# Altium project ISPR_DEOP.PrjPcb
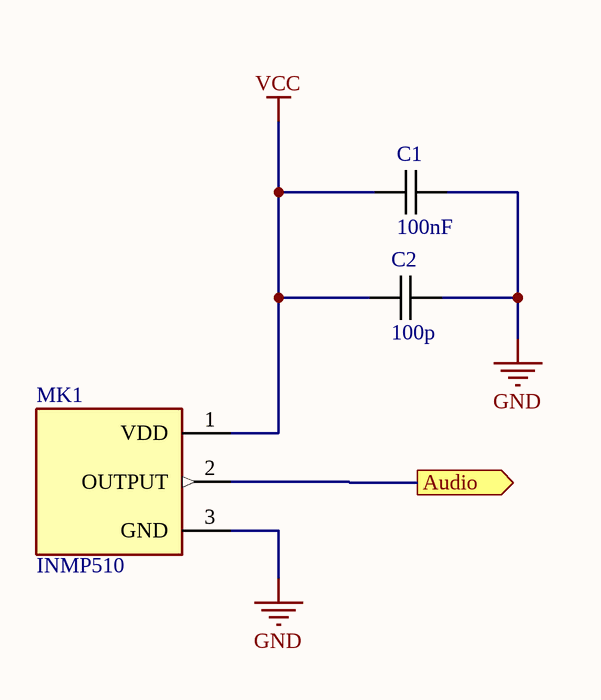
[diagram p0: Microfono.SchDoc]
3 sheets, 36 parts. Net scope: flat (ports and power ports of the same name join across sheets).
Board file: PCB_Microfonos.PcbDoc
Sheets:
  Microfono.SchDoc
  Filter.SchDoc
  Connector.SchDoc

## Sheet Microfono.SchDoc: Microfono
size A4; Author: Jose Luis Llorente Gonzalez; CompanyName: ETSIT; Organization: UPM; Revision: V1.0

### Parts
C1  100nF  [0805C-TBD]
C2  100p  [0805C-GENERIC]
MK1  INMP510  [XDCR_INMP510]

### Ports
Audio (out)

### Nets
GND: C1.2 C2.2 MK1.3(GND)
VCC: C1.1 C2.1 MK1.1(VDD)
NetC5_1: MK1.2(OUTPUT) ; port Audio

### Notes on the sheet
- Title
- Size:
- Date:
- A4
- Number:
- Time:
- Revision:
- Sheet
- of
- File:

### Library data of the parts
C1 = 0805C-100nF-25V-X7R-MUR: CAPACITOR 0805 CERAMIC; Supplier 1: Digi-Key; Supplier Part Number 1: 490-1673-1-ND
C2 = C0805-GENERIC: GENERIC CAPACITOR NON POLARISED0603
MK1 = INMP510: 60Hz ~ 20kHz Analog Microphone MEMS _Silicon_ 1.5V ~ 3.63V Omnidirectional _-38dB Â±2dB @ 94dB SPL_ Solder Pads; MF: TDK InvenSense; Value: *; MP: INMP510; SnapEDA_Link: https://www.snapeda.com/parts/INMP510/TDK%20InvenSense/view-part/2757133/?ref=snap; Package: LGA-3 TDK-InvenSense; Digi-Key_Part_Number: 1428-1016-2-ND; Digi-Key_Purchase_URL: https://www.digikey.com/product-detail/en/tdk-invensense/INMP510ACEZ-R7/1428-1016-2-ND/4311534?utm_source=snapeda&utm_medium=aggregator&utm_campaign=symbol

## Sheet Filter.SchDoc: Filter & amplification
size A4; Author: Jose Luis Llorente Gonzalez; CompanyName: ETSIT; Organization: UPM; Revision: V1.0
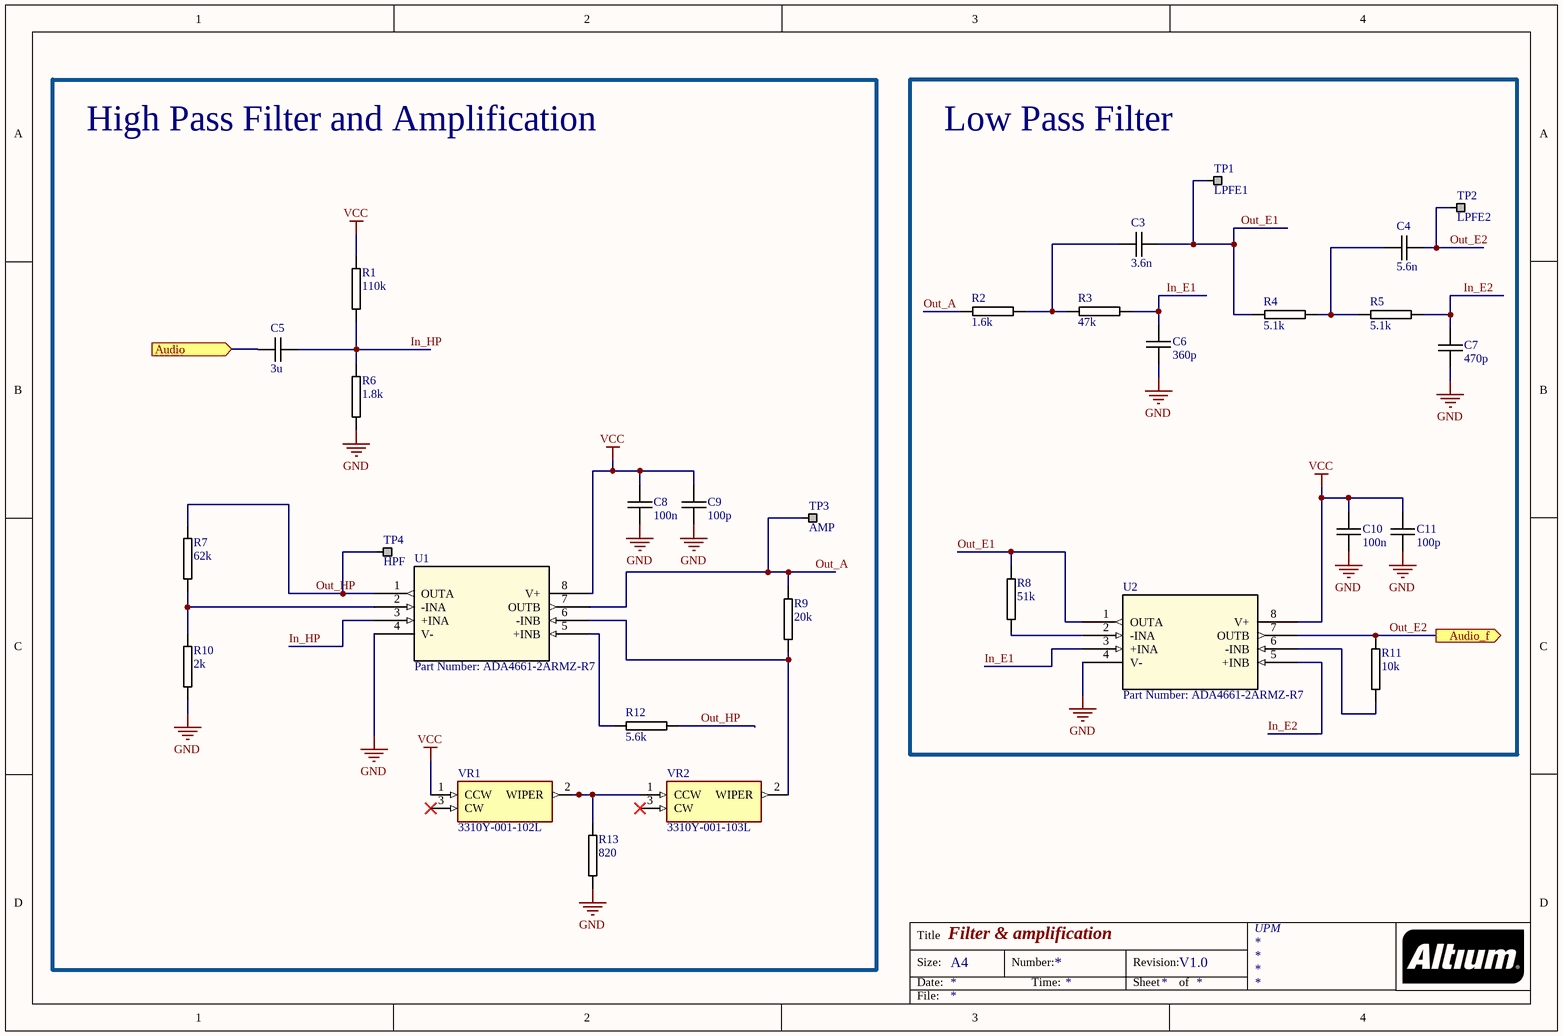
[diagram p1: Filter.SchDoc]

### Parts
C3  3.6n  [0805C-GENERIC]
C4  5.6n  [0805C-GENERIC]
C5  3u  [0805C-GENERIC]
C6  360p  [0805C-GENERIC]
C7  470p  [0805C-GENERIC]
C8  100n  [0805C-GENERIC]
C9  100p  [0805C-GENERIC]
C10  100n  [0805C-GENERIC]
C11  100p  [0805C-GENERIC]
R1  110k  [0805R-GENERIC]
R2  1.6k  [0805R-GENERIC]
R3  47k  [0805R-GENERIC]
R4  5.1k  [0805R-GENERIC]
R5  5.1k  [0805R-GENERIC]
R6  1.8k  [0805R-GENERIC]
R7  62k  [0805R-GENERIC]
R8  51k  [0805R-GENERIC]
R9  20k  [0805R-GENERIC]
R10  2k  [0805R-GENERIC]
R11  10k  [0805R-GENERIC]
R12  5.6k  [0805R-GENERIC]
R13  820  [0805R-GENERIC]
TP1  LPFE1  [TESTPIN]
TP2  LPFE2  [TESTPIN]
TP3  AMP  [TESTPIN]
TP4  HPF  [TESTPIN]
U1  Part Number: ADA4661-2ARMZ-R7  [RM_8]
U2  Part Number: ADA4661-2ARMZ-R7  [RM_8]
VR1  3310Y-001-102L  [3310Y-001]
VR2  3310Y-001-103L  [3310Y-001]

### Blocks framed on the sheet
High Pass Filter and Amplification: C5 C8 C9 R1 R6 R7 R9 R10 R12 R13 TP3 TP4 U1 VR1 VR2
Low Pass Filter: C3 C4 C6 C7 C10 C11 R2-R5 R8 R11 TP1 TP2 U2

### Ports
Audio (in), Audio_f (out)

### Nets
GND: C6.1 C7.1 C8.2 C9.2 C10.2 C11.2 R6.2 R10.2 R13.2 U1.4(V-) U2.4(V-)
VCC: C8.1 C9.1 C10.1 C11.1 R1.1 U1.8(V+) U2.8(V+) VR1.1(CCW)
In_E1: C6.2 R3.2 U2.3(+INA)
In_E2: C7.2 R5.2 U2.5(+INB)
In_HP: C5.2 R1.2 R6.1 U1.3(+INA)
Out_A: R2.1 R9.1 TP3.1 U1.7(OUTB)
Out_E1: C3.2 R4.1 R8.1 TP1.1 U2.1(OUTA)
Out_E2: C4.2 R11.1 TP2.1 U2.7(OUTB) ; port Audio_f
Out_HP: R7.1 R12.2 TP4.1 U1.1(OUTA)
NetC3_1: C3.1 R2.2 R3.1
NetC4_1: C4.1 R4.2 R5.1
NetC5_1: C5.1 ; port Audio
NetR7_2: R7.2 R10.1 U1.2(-INA)
NetR8_2: R8.2 U2.2(-INA)
NetR9_2: R9.2 U1.6(-INB) VR2.2(WIPER)
NetR11_2: R11.2 U2.6(-INB)
NetR12_1: R12.1 U1.5(+INB)
NetR13_1: R13.1 VR1.2(WIPER) VR2.1(CCW)

Not connected (* = marked no-connect by the designer): VR1 3(CW)*; VR2 3(CW)*

### Notes on the sheet
- Title
- Size:
- Date:
- A4
- Number:
- Time:
- Revision:
- Sheet
- of
- File:

### Library data of the parts
C3-C11 = C0805-GENERIC: GENERIC CAPACITOR NON POLARISED0603
R1-R13 = R0805-GENERIC: GENERIC RESISTOR 0805
TP1-TP4 = TESTPIN: TESTPIN SINGLE PIN HEADER; Manufacturer 1: Sharon Long Industries; Manufacturer Part Number 1: Cut-it-yourself; Reel: TH; Supplier 1: Sharon Long Industries; Supplier 1 Part number: Cut-It-Yourself
U1 U2 = ADA4661-2ARMZ-R7: No Description Available; Built_By: EMA_Christopher; Vendor: Analog Devices Inc; Copyright: Copyright (C) 2016 Accelerated Designs. All rights reserved; Manufacturer_Part_Number: ADA4661-2ARMZ-R7; RefDes: RefDes; Type: DEV; Value: Value
VR1 VR2 = 3310Y-001-103L: Variable Resistor; Manufacturer_Name: Bourns; Datasheet Link: http://www.bourns.com/docs/Product-Datasheets/3310.pdf; Manufacturer_Part_Number: 3310Y-001-103L; Mouser Part Number: 652-3310Y-001-103L; Mouser Price/Stock: https://www.mouser.com/Search/Refine.aspx?Keyword=652-3310Y-001-103L; RS Part Number: 5220625P; RS Price/Stock: http://uk.rs-online.com/web/p/products/5220625P

## Sheet Connector.SchDoc: Connector
size A4; Author: Jose Luis Llorente Gonzalez; CompanyName: ETSIT; Organization: UPM; Revision: V1.0
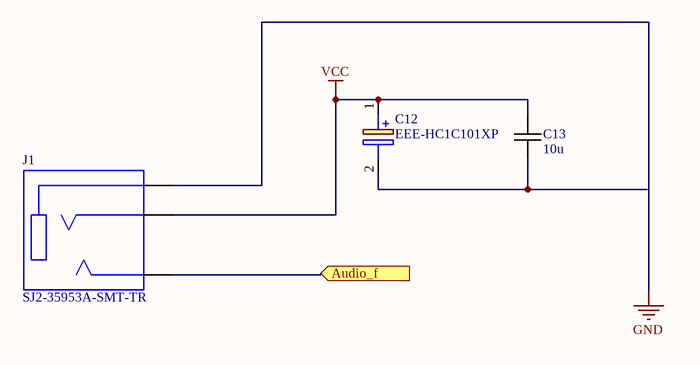
[diagram p2: Connector.SchDoc]

### Parts
C12  EEE-HC1C101XP  [CAPAE660X800N]
C13  10u  [0805C-GENERIC]
J1  SJ2-35953A-SMT-TR  [CUI_SJ2-35953A-SMT-TR]

### Ports
Audio_f (in)

### Nets
GND: J1.1(SLEEVE)
VCC: C12.1(+) C13.1 J1.3(RING1)
Out_E2: J1.2(TIP) ; port Audio_f
NetC12_2: C12.2(-) C13.2

### Notes on the sheet
- Title
- Size:
- Date:
- A4
- Number:
- Time:
- Revision:
- Sheet
- of
- File:

### Library data of the parts
C12 = EEE-HC1C101XP: Capacitor Polarised; Manufacturer_Name: Panasonic; Allied_Number: 70258549; Datasheet Link: http://industrial.panasonic.com/www-cgi/jvcr13pz.cgi?E+PZ+3+ABA0109+EEEHC1C101XP+7+WW; Height: 8mm; Manufacturer_Part_Number: EEE-HC1C101XP; Mouser Part Number: 667-EEE-HC1C101XP; Mouser Price/Stock: https://www.mouser.com/Search/Refine.aspx?Keyword=667-EEE-HC1C101XP; Allied Price/Stock: https://www.alliedelec.com/panasonic-eee-hc1c101xp/70258549/
C13 = C0805-GENERIC: GENERIC CAPACITOR NON POLARISED0603
J1 = SJ2-35953A-SMT-TR: 3.5 mm, Stereo, Right Angle, Surface Mount _SMT_, Audio Jack Connector; MF: CUI Devices; Price: None; Availability: Unavailable; SnapEDA_Link: https://www.snapeda.com/parts/SJ2-35953A-SMT-TR/CUI%20Devices/view-part/701771/?ref=snap; MP: SJ2-35953A-SMT-TR; CUI_purchase_URL: https://www.cuidevices.com/product/interconnect/connectors/audio-connectors/jacks/sj2-3595x-smt-series?utm_source=snapeda.com&utm_medium=referral&utm_campaign=snapedaBOM; Value: *; Package: None

## Nets that join several sheets
GND: Microfono (C1.2 C2.2 MK1.3), Filter (11 pins), Connector (J1.1)
VCC: Microfono (C1.1 C2.1 MK1.1), Filter (8 pins), Connector (C12.1 C13.1 J1.3)
NetC5_1: Microfono (MK1.2), Filter (C5.1)
Out_E2: Filter (C4.2 R11.1 TP2.1 U2.7), Connector (J1.2)